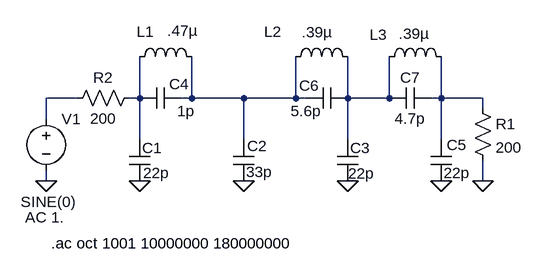
[diagram p0: schematic Cauer_DDS_65MHz_7branch.asc]
Cauer_DDS_65MHz_7branch.asc, the LTspice schematic file:
Version 4
SHEET 1 880 680
WIRE -192 80 -240 80
WIRE -96 80 -96 16
WIRE -96 80 -112 80
WIRE -16 80 -16 16
WIRE -16 80 -32 80
WIRE 64 80 -16 80
WIRE 144 80 144 16
WIRE 144 80 64 80
WIRE 160 80 144 80
WIRE 224 80 224 16
WIRE 288 80 288 16
WIRE 288 80 224 80
WIRE 368 80 368 16
WIRE 368 80 352 80
WIRE 432 80 368 80
WIRE 432 96 432 80
WIRE -240 112 -240 80
WIRE -96 144 -96 80
WIRE 64 144 64 80
WIRE 224 144 224 80
WIRE 368 144 368 80
WIRE -240 208 -240 192
WIRE 432 208 432 176
FLAG -96 208 0
FLAG 64 208 0
FLAG 224 208 0
FLAG 432 208 0
FLAG 368 208 0
FLAG -240 208 0
SYMBOL cap -112 144 R0
WINDOW 0 20 13 Left 2
WINDOW 3 21 51 Left 2
SYMATTR InstName C1
SYMATTR Value 22p
SYMBOL cap 48 144 R0
WINDOW 0 21 10 Left 2
WINDOW 3 20 50 Left 2
SYMATTR InstName C2
SYMATTR Value 33p
SYMBOL cap 208 144 R0
WINDOW 0 20 13 Left 2
WINDOW 3 17 52 Left 2
SYMATTR InstName C3
SYMATTR Value 22p
SYMBOL cap -96 96 R270
WINDOW 0 22 61 VTop 2
WINDOW 3 12 71 VBottom 2
SYMATTR InstName C4
SYMATTR Value 1p
SYMBOL cap 352 144 R0
WINDOW 3 20 51 Left 2
SYMATTR Value 22p
SYMATTR InstName C5
SYMBOL cap 160 96 R270
WINDOW 0 20 5 VTop 2
WINDOW 3 12 0 VBottom 2
SYMATTR InstName C6
SYMATTR Value 5.6p
SYMBOL ind -112 32 R270
WINDOW 0 39 25 VTop 2
WINDOW 3 40 82 VTop 2
SYMATTR InstName L1
SYMATTR Value .47µ
SYMATTR SpiceLine Rser=.1
SYMBOL ind 128 32 R270
WINDOW 0 39 -19 VTop 2
WINDOW 3 38 49 VTop 2
SYMATTR InstName L2
SYMATTR Value .39µ
SYMATTR SpiceLine Rser=.1
SYMBOL ind 272 32 R270
WINDOW 0 34 -1 VTop 2
WINDOW 3 36 54 VTop 2
SYMATTR InstName L3
SYMATTR Value .39µ
SYMATTR SpiceLine Rser=.1
SYMBOL res -208 96 R270
WINDOW 0 32 56 VTop 2
WINDOW 3 0 56 VBottom 2
SYMATTR InstName R2
SYMATTR Value 200
SYMBOL voltage -240 96 R0
WINDOW 3 -39 144 Left 2
WINDOW 123 -32 168 Left 2
WINDOW 39 0 0 Left 2
SYMATTR Value SINE(0)
SYMATTR Value2 AC 1.
SYMATTR InstName V1
SYMBOL res 416 80 R0
SYMATTR InstName R1
SYMATTR Value 200
SYMBOL cap 288 96 R270
WINDOW 0 32 32 VTop 2
WINDOW 3 0 32 VBottom 2
SYMATTR InstName C7
SYMATTR Value 4.7p
TEXT -232 304 Left 2 !.ac oct 1001 10000000 180000000

The netlist it stands for:
* Cauer_DDS_65MHz_7branch.asc
C1 N002 0 22p
C2 N003 0 33p
C3 N004 0 22p
C4 N002 N003 1p
C5 N005 0 22p
C6 N003 N004 5.6p
L1 N002 N003 .47µ Rser=.1
L2 N003 N004 .39µ Rser=.1
L3 N004 N005 .39µ Rser=.1
R2 N001 N002 200
V1 N001 0 SINE(0) AC 1.
R1 N005 0 200
C7 N004 N005 4.7p
.ac oct 1001 10000000 180000000
.backanno
.end